# EAGLE design emonDCmini v0.6b (EAGLE 8.3.2)
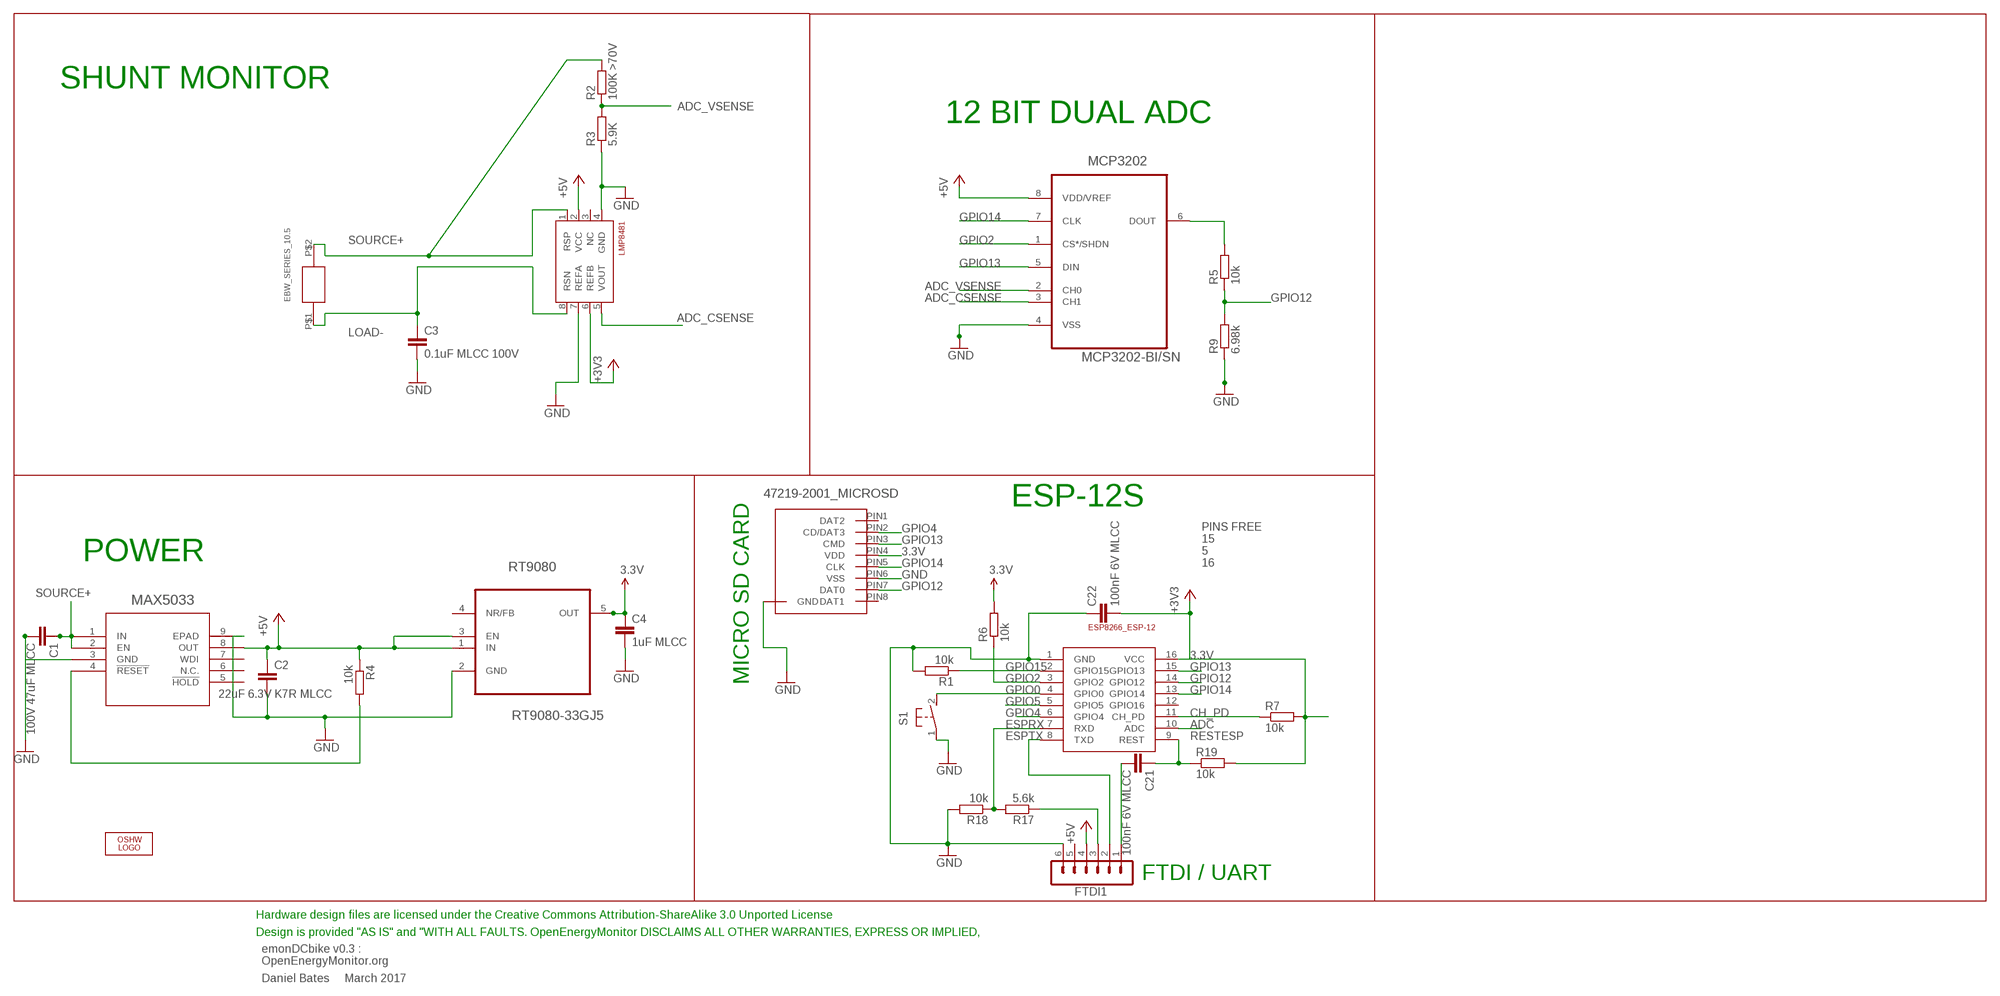
[diagram p0: schematic, sheet 1]

## Parts
C1  100V 47uF MLCC  C-EUC1206  [C1206]
C2  22uF 6.3V K7R MLCC  C-EUC1206  [C1206]
C3  0.1uF MLCC 100V  C-EUC0603  [C0603]
C4  1uF MLCC  C-EUC0603  [C0603]
C21  100nF 6V MLCC  C-EUC0603  [C0603]
C22  100nF 6V MLCC  C-EUC0603  [C0603]
EBW_SERIES_10.5  EBW_SERIES_10.5MM  [EBW_SERIES_10.5MM]
ESP-12  ESP8266_ESP-12  [ESP8266-ESP12]
FTDI1  FTDI-ESP  MA06-1  [MA06-1]
LMP8481  LMP8481-H  LMP8481LMP8481-H  [S-PDSO-G08]
LOGO1  OSHW_LOGO_6MILX0200-NT  [OSHW_6X200_NOTEXT]
MAX5033  MAX5033BUSA+  [21-0111D_SBE-14]
MCP3202  MCP3202-BI/SN  [SOIC127P600X175-8N]
R1  10k  R-EU_R0603  [R0603]
R2  100K >70V  R-EU_R0603  [R0603]
R3  5.9K  R-EU_R0603  [R0603]
R4  10k  R-EU_R0603  [R0603]
R5  10k  R-EU_R0603  [R0603]
R6  10k  R-EU_R0603  [R0603]
R7  10k  R-EU_R0603  [R0603]
R9  6.98k  R-EU_R0603  [R0603]
R17  5.6k  R-EU_R0603  [R0603]
R18  10k  R-EU_R0603  [R0603]
R19  10k  R-EU_R0603  [R0603]
RT9080  RT9080-33GJ5  [TSOT-23-5]
S1  DTSM-3  [DTSM-3]
U$1  47219-2001_MICROSD  [47219-2001_MICROSD]

## Nets
3.3V: C4.1 C22.2 ESP-12.16(VCC) LMP8481.6(REFB) R6.2 R7.2 R19.2 RT9080.5(OUT) U$1.PIN4(VDD) ; supply symbol labelled +3V3
+5V: C2.1 FTDI1.4 MAX5033.8(OUT) MCP3202.8(VDD/VREF) R4.1 RT9080.1(IN) RT9080.3(EN)
ADC: ESP-12.10(ADC)
ADC_CSENSE: LMP8481.5(VOUT) MCP3202.3(CH1)
ADC_VSENSE: MCP3202.2(CH0) R2.1 R3.2
CH_PD: ESP-12.11(CH_PD) R7.1
ESPRX: ESP-12.7(RXD) R17.2 R18.1
ESPTX: ESP-12.8(TXD) FTDI1.2
GND [thin_power]: C1.2 C2.2 C3.2 C4.2 C22.1 ESP-12.1(GND) FTDI1.6 LMP8481.4(GND) LMP8481.7(REFA) MAX5033.3(GND) MAX5033.9(EPAD) MCP3202.4(VSS) R1.2 R3.1 R9.1 R18.2 RT9080.2(GND) S1.1 U$1.P$1(GND) U$1.P$2(GND) U$1.P$3(GND) U$1.P$4(GND) U$1.PIN6(VSS)
GPIO0: ESP-12.4(GPIO0) S1.2
GPIO2: ESP-12.3(GPIO2) MCP3202.1(CS*/SHDN) R6.1
GPIO4: ESP-12.6(GPIO4) U$1.PIN2(CD/DAT3)
GPIO5: ESP-12.5(GPIO5)
GPIO12: ESP-12.14(GPIO12) R5.1 R9.2 U$1.PIN7(DAT0)
GPIO12A: MCP3202.6(DOUT) R5.2
GPIO13: ESP-12.15(GPIO13) MCP3202.5(DIN) U$1.PIN3(CMD)
GPIO14: ESP-12.13(GPIO14) MCP3202.7(CLK) U$1.PIN5(CLK)
GPIO15: ESP-12.2(GPIO15) R1.1
LOAD- [power]: C3.1 EBW_SERIES_10.5.P$1 LMP8481.8(RSN)
N$1: MAX5033.4(!RESET) R4.2
N$36: FTDI1.3 R17.1
RESTESP: C21.1 ESP-12.9(REST) R19.1
RST: C21.2 FTDI1.1
SOURCE+ [power]: C1.1 EBW_SERIES_10.5.P$2 LMP8481.1(RSP) MAX5033.1(IN) MAX5033.2(EN) R2.2
Unconnected: ESP-12.12(GPIO16) FTDI1.5 LMP8481.2(VCC) LMP8481.3(NC) MAX5033.5(!HOLD) MAX5033.6(N.C.) MAX5033.7(WDI) RT9080.4(NR/FB) U$1.PIN1(DAT2) U$1.PIN8(DAT1)

## Notes on the sheet
- SHUNT MONITOR
- 12 BIT DUAL ADC
- ESP-12S
- POWER
- PINS FREE
  15
  5
  16
- MAX5033
- MICRO SD CARD
- FTDI / UART
- Hardware design files are licensed under the Creative Commons Attribution-ShareAlike 3.0 Unported License
- Design is provided "AS IS" and "WITH ALL FAULTS. OpenEnergyMonitor DISCLAIMS ALL OTHER WARRANTIES, EXPRESS OR IMPLIED,
- emonDCbike v0.3 :
  OpenEnergyMonitor.org
- Daniel Bates     March 2017

## Library data of the parts
C1-C4 C21 C22 = rcl:C-EU: CAPACITOR, European symbol
EBW_SERIES_10.5 = EBW series shunt:EBW_SERIES_10.5MM
ESP-12 = ESP8266-ESP12:ESP8266_ESP-12
FTDI1 = JeeLabs:MA06-1: PIN HEADER
LMP8481 = lmp8481b:LMP8481: LMP8481MM-H/NOPB 100V/V
LOGO1 = ohw-logo:OSHW_LOGO_6MIL; OC_FARNELL: unknown
MAX5033 = MAX5033:MAX5033BUSA+: VOLTAGE REGULATOR 3.3V; MANUFACTURER_PART_NUMBER: MAX5033BUSA+; VENDOR: MAXIM
MCP3202 = Microchip-MCP3202-BI_SN:MCP3202-BI/SN: IC ADC 12BIT 2.7V 2CH SPI,SOIC-8; MPN: MCP3202-BI/SN; OC_FARNELL: 1196803; OC_NEWARK: 96K3721; PACKAGE: SOIC-8; SUPPLIER: Microchip
R1 R4 R6 R7 R17-R19 = rcl:R-EU_: RESISTOR, European symbol
R2 = rcl:R-EU_: RESISTOR, European symbol; MPN: MCWR06X1003FTL
R3 R5 R9 = rcl:R-EU_: RESISTOR, European symbol; MPN: MCWR06X5901FTL
RT9080 = TSOT-23-5 REGULATOR 3.3v:RT9080-33GJ5: Low-Dropout Regulator; OC_FARNELL: 2679852; PACKAGE: SOT-23-5
S1 = switch-tact:DTSM-3
U$1 = MOLEX 47219-2001:47219-2001_MICROSD

## Net classes
1 power: width 1.016 mm
2 thin_power: width 0.254 mm

## Board
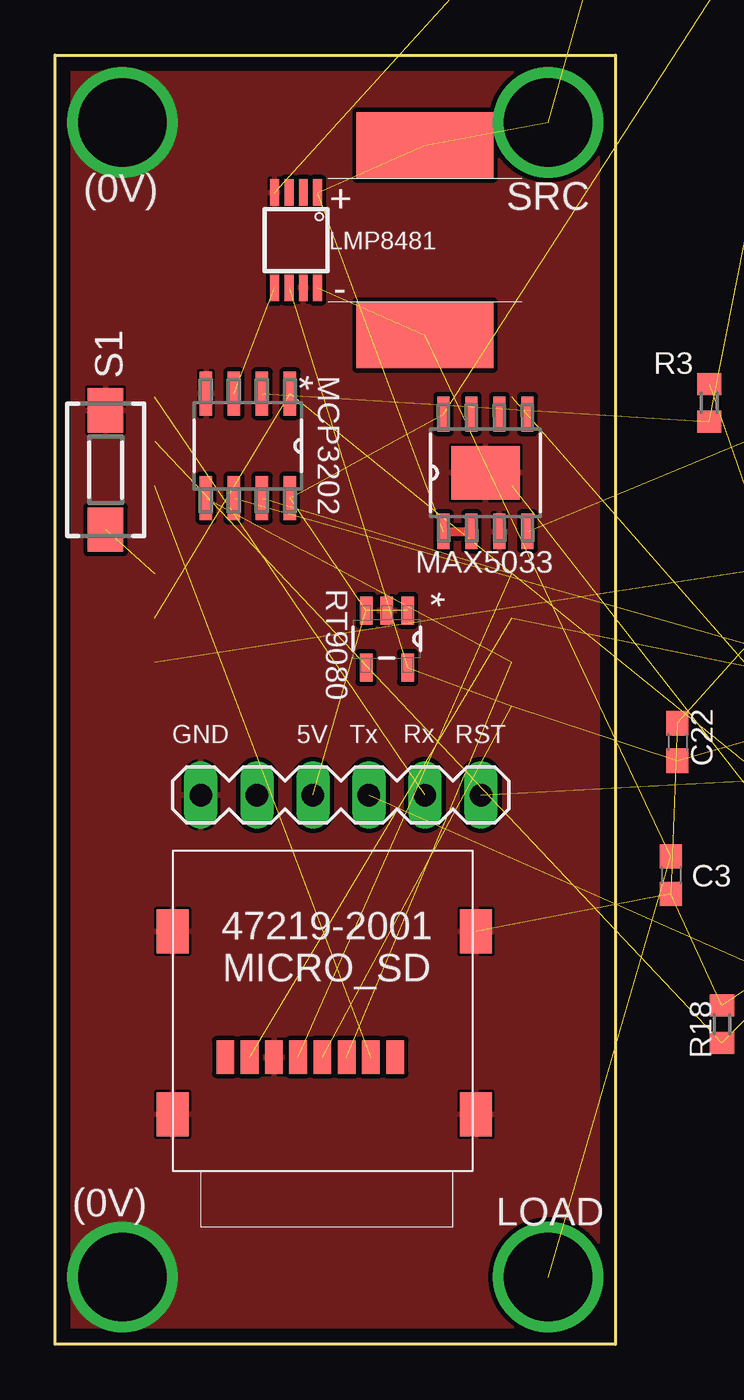
[diagram p1: board, top side]
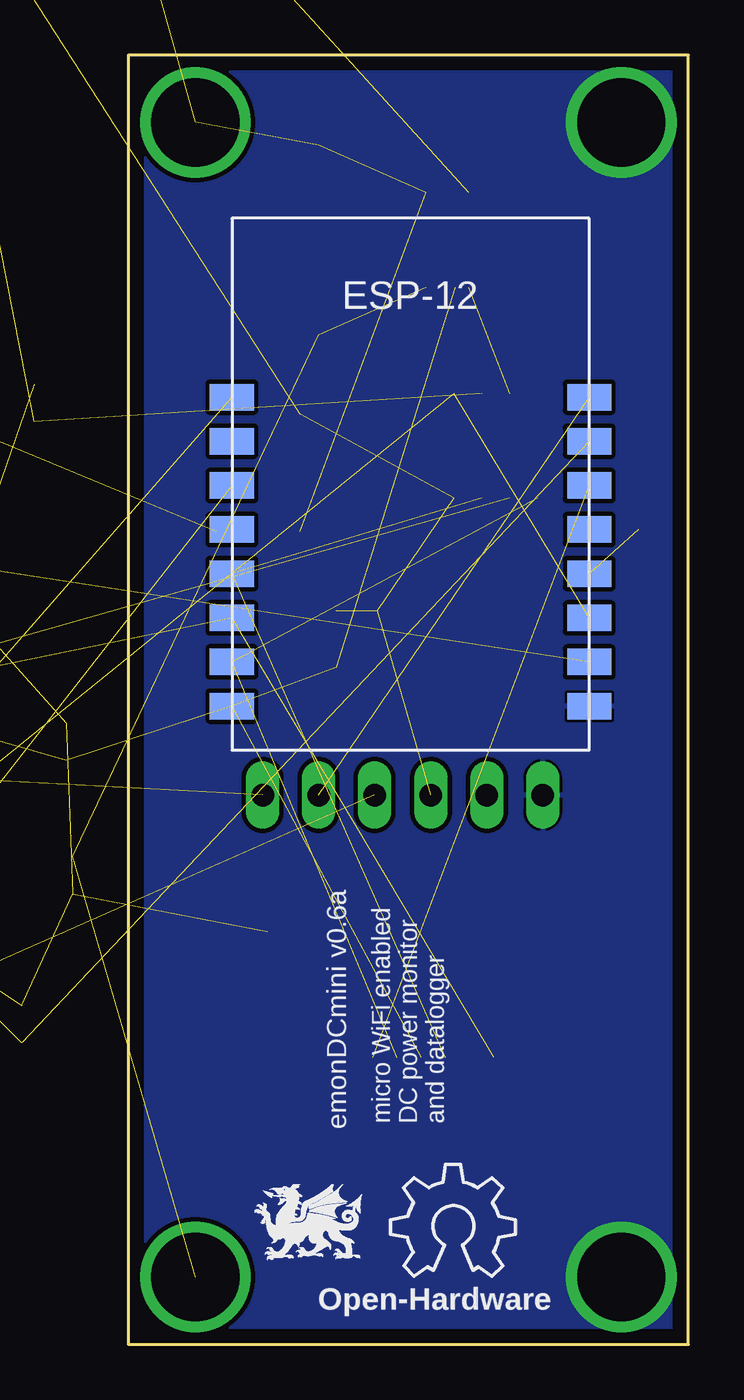
[diagram p2: board, bottom side, seen from below]

Size 25.4 x 58.42 mm. Coordinates in mm from the lower left corner, seen from the top.
Outline: 0,58.42 25.4,58.42 25.4,0 0,0 0,58.42
Copper layers (1*16): Top 0.035mm / dielectric 1.5mm / Bottom 0.035mm
Design rules "default *": minimum track width 10mil, minimum drill 19mil, track to track 8mil, track to pad 8mil, pad to pad 8mil, via to via 8mil, smd to smd 8mil, copper to edge 25mil, drill to drill 8mil, minimum pad ring 10mil, minimum via ring 8mil, stop-mask expansion 4mil, vias tented up to drill 0mil, thermal gap 5mil

### Footprints (pad centres in the part's own frame; a part is rotated, then mirrored left to right if it is on the bottom)
C1206 = smd 1.6 x 1.8: 1 -1.4,0; 2 1.4,0
C0603 = smd 1.1 x 1: 1 -0.85,0; 2 0.85,0
EBW_SERIES_10.5MM = smd 3 x 6.2: P$1 -4.3,0; P$2 4.3,0
ESP8266-ESP12 = smd 2 x 1.2: 1 16.2,2; 2 16.2,4; 3 16.2,6; 4 16.2,8; 5 16.2,10; 6 16.2,12; 7 16.2,14; 8 16.2,16; 9 0,16; 10 0,14; 11 0,12; 12 0,10; 13 0,8; 14 0,6; 15 0,4; 16 0,2
MA06-1 = drill 1.016 long: 1 0,0; 2 2.54,0; 3 5.08,0; 4 7.62,0; 5 10.16,0; 6 12.7,0
S-PDSO-G08 = smd 0.4 x 1.2: 1 -0.975,-2.157; 2 -0.325,-2.157; 3 0.325,-2.157; 4 0.975,-2.157; 5 0.975,2.157; 6 0.325,2.157; 7 -0.325,2.157; 8 -0.975,2.157
21-0111D_SBE-14 = smd 1.6 x 0.533: 1 -2.654,1.905; 2 -2.654,0.635; 3 -2.654,-0.635; 4 -2.654,-1.905; 5 2.654,-1.905; 6 2.654,-0.635; 7 2.654,0.635; 8 2.654,1.905 | smd 2.413 x 3.099: 9 0,0
SOIC127P600X175-8N = smd 1.981 x 0.559: 1 -2.362,1.905; 2 -2.362,0.635; 3 -2.362,-0.635; 4 -2.362,-1.905; 5 2.362,-1.905; 6 2.362,-0.635; 7 2.362,0.635; 8 2.362,1.905
R0603 = smd 1 x 1.1: 1 -0.85,0; 2 0.85,0
TSOT-23-5 = smd 1.27 x 0.559: 1 -1.295,0.94; 2 -1.295,0; 3 -1.295,-0.94; 4 1.295,-0.94; 5 1.295,0.94
DTSM-3 = smd 2 x 1.6: 1 -2.7,0; 2 2.7,0
47219-2001_MICROSD = smd 1.45 x 2: P$1 0,0; P$2 13.75,0; P$3 0,8.3; P$4 13.75,8.3 | smd 0.8 x 1.5: PIN1 10.08,2.6; PIN2 8.98,2.6; PIN3 7.88,2.6; PIN4 6.78,2.6; PIN5 5.68,2.6; PIN6 4.58,2.6; PIN7 3.48,2.6; PIN8 2.38,2.6

### Placement (x,y rotation side)
C1  23.99,66.14 180 top  (outside the outline)
C2  31.51,65.96 180 top  (outside the outline)
C3  27.91,21.26 270 top
C4  45.93,42.53 0 top  (outside the outline)
C21  37.08,24.99 90 top  (outside the outline)
C22  28.21,27.3 270 top
EBW_SERIES_10.5  16.76,50.04 90 top
ESP-12  20.7,26.92 0 bottom
FTDI1  19.3,24.89 180 top
LMP8481  10.92,50.04 180 top
LOGO1  13.5,3.07 0 bottom
MAX5033  19.51,39.5 90 top
MCP3202  8.74,40.72 270 top
R1  33.1,34.47 270 top  (outside the outline)
R2  33.87,58.99 0 top  (outside the outline)
R3  29.65,42.67 270 top  (outside the outline)
R4  45.38,47.61 270 top  (outside the outline)
R5  38.91,29.35 0 top  (outside the outline)
R6  37.9,20.17 270 top  (outside the outline)
R7  33.07,23.93 90 top  (outside the outline)
R9  41.88,22.51 0 top  (outside the outline)
R17  34.29,16.89 90 top  (outside the outline)
R18  30.23,14.5 90 top  (outside the outline)
R19  32.56,28.55 270 top  (outside the outline)
RT9080  15.04,31.97 270 top
S1  2.29,39.62 270 top
U$1  5.33,10.41 0 top
U$3  [DRAGON_LOGO_NOTEXT]  17.07,5.51 0 bottom

### Tracks (layer width: path | path; a pad name or v marks a point on that pad's centre or on a via)
3.3V  (8 unrouted)
+5V  (6 unrouted)
ADC_CSENSE  (1 unrouted)
ADC_VSENSE  (2 unrouted)
CH_PD  (1 unrouted)
ESPRX  (2 unrouted)
ESPTX  (1 unrouted)
GND  (via drill 4)  (9 unrouted)
  other vias: 3.05,3.05 3.05,55.37
  pour Top: 0.25,58.17 25.15,58.17 25.15,0.25 0.25,0.25
  pour Bottom: 0.25,58.17 25.15,58.17 25.15,0.25 0.25,0.25
GPIO0  (1 unrouted)
GPIO2  (2 unrouted)
GPIO4  (1 unrouted)
GPIO12  (3 unrouted)
GPIO12A  (1 unrouted)
GPIO13  (2 unrouted)
GPIO14  (2 unrouted)
GPIO15  (1 unrouted)
LOAD-  (via drill 4)  (3 unrouted)
  other vias: 22.35,3.05
N$1  (1 unrouted)
N$36  (1 unrouted)
RESTESP  (2 unrouted)
RST  (1 unrouted)
SOURCE+  (via drill 4)  (5 unrouted)
  Top 0.406: MAX5033.1 MAX5033.2
  other vias: 22.35,55.37
(copper drawn outside any net)
  shapes: Bottom area x1

### Text on the board
bPlace: Open-Hardware
tNames: (0V) | SRC | GND | 5V | Tx | Rx | RST | (0V) | LOAD
bNames: micro WiFi enabled / DC power monitor / and datalogger | emonDCmini v0.6a
_tsilk: Designed in | North Wales | Made in UK
_bsilk: SMT V0.6 rev3 | emonTx | wireless energy monitoring node | SMT V0.6 rev3 | emonTx | SMT V0.6 rev3 | emonTx | Technology that helps us live within ecological limits | wireless energy monitoring node | wireless energy monitoring node | Designed in North Wales UK by Glyn Hudson & Trystan Lea | Technology that helps us live within ecological limits | Technology that helps us live within ecological limits | Designed in North Wales UK by Glyn Hudson & Trystan Lea | 165mm ant | 433Mhz | Designed in North Wales UK by Glyn Hudson & Trystan Lea | 165mm ant | 165mm ant | 433Mhz | 433Mhz | 868Mhz | 82mm ant | 82mm ant | 82mm ant | 868Mhz | 868Mhz | 78mm ant | 915Mhz | 78mm ant | 915Mhz | 78mm ant | 915Mhz | 165mm ant | 433Mhz | 82mm ant | 868Mhz | 78mm ant | 915Mhz